# EAGLE design SensorBoard (EAGLE 6.4)
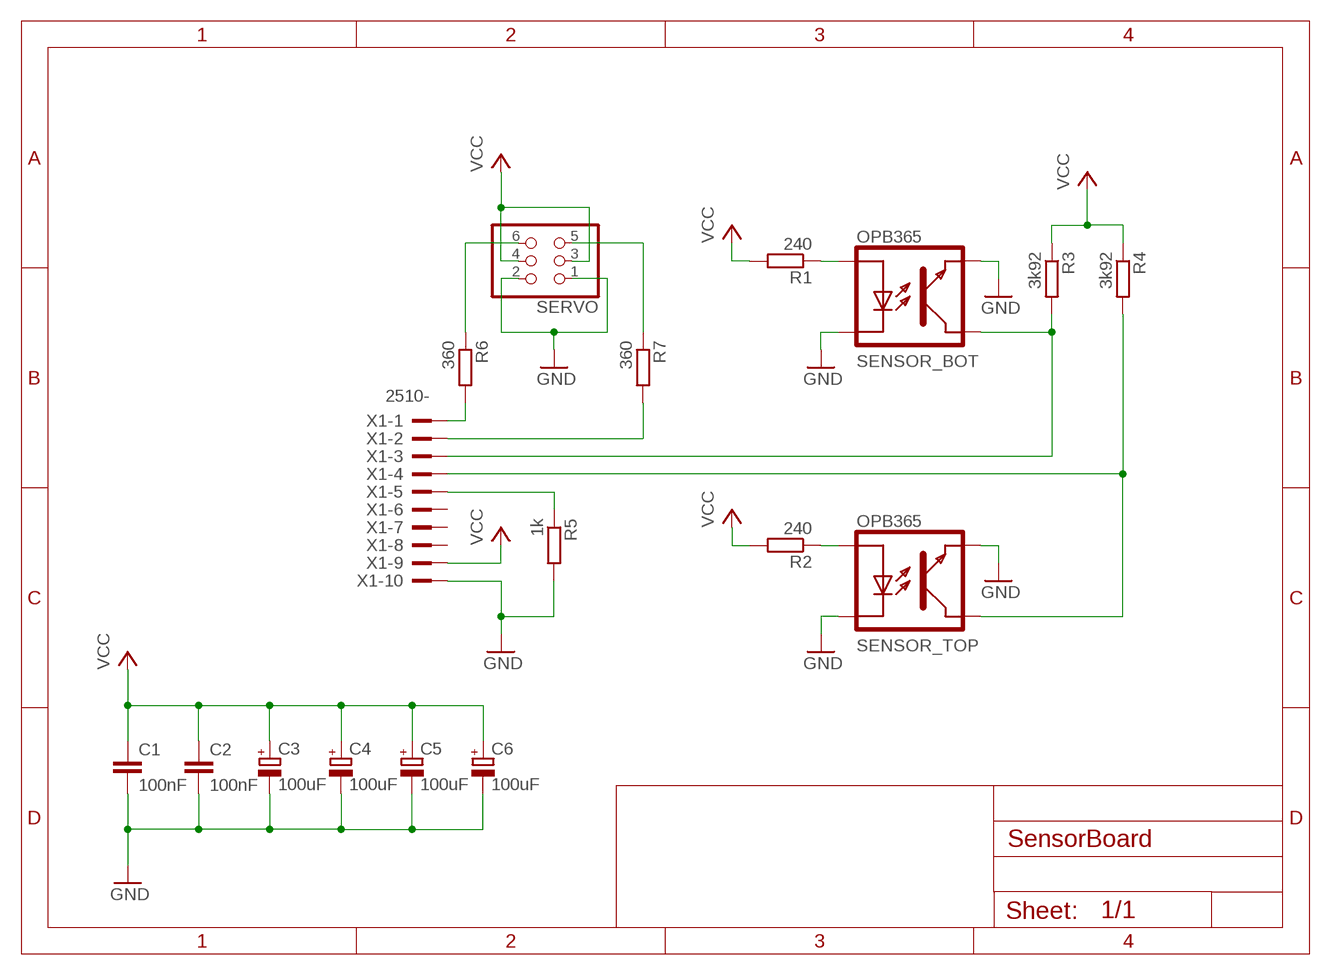
[diagram p0: schematic, sheet 1]

## Parts
C1  100nF  C-EUC1206  [C1206]
C2  100nF  C-EUC1206  [C1206]
C3  100uF  CPOL-EUSMCD  [SMC_D]
C4  100uF  CPOL-EUSMCD  [SMC_D]
C5  100uF  CPOL-EUSMCD  [SMC_D]
C6  100uF  CPOL-EUSMCD  [SMC_D]
R1  240  R-EU_R1206  [R1206]
R2  240  R-EU_R1206  [R1206]
R3  3k92  R-EU_R1206  [R1206]
R4  3k92  R-EU_R1206  [R1206]
R5  1k  R-EU_R1206  [R1206]
R6  360  R-EU_R1206  [R1206]
R7  360  R-EU_R1206  [R1206]
SENSOR_BOT  OPB365T  [OPB365-T]
SENSOR_TOP  OPB365T  [OPB365-T]
SERVO  PINHD-2X3/90  [2X03/90]
X1  2510-  [PAK100/2500-10]

## Nets
GND: C1.2 C2.2 C3.- C4.- C5.- C6.- R5.2 SENSOR_BOT.2 SENSOR_BOT.4 SENSOR_TOP.2 SENSOR_TOP.4 SERVO.1 SERVO.2 X1.10
N$1: R2.1 SENSOR_TOP.1
N$2: R1.1 SENSOR_BOT.1
N$3: R4.2 SENSOR_TOP.3 X1.4
N$4: R3.2 SENSOR_BOT.3 X1.3
N$5: R5.1 X1.5
N$6: R6.1 SERVO.6
N$7: R7.2 X1.2
N$8: R6.2 X1.1
N$9: R7.1 SERVO.5
VCC: C1.1 C2.1 C3.+ C4.+ C5.+ C6.+ R1.2 R2.2 R3.1 R4.1 SERVO.3 SERVO.4 X1.9
Unconnected: X1.6 X1.7 X1.8

## Library data of the parts
C1 C2 = rcl:C-EU: CAPACITOR, European symbol
C3-C6 = rcl:CPOL-EU: POLARIZED CAPACITOR, European symbol
R1-R7 = rcl:R-EU_: RESISTOR, European symbol
SENSOR_BOT SENSOR_TOP = tpv:OPB365T
SERVO = pinhead:PINHD-2X3: PIN HEADER
X1 = con-3m:2510-: 3M (TM) Pak 100 4-Wall Header Source: 3M; MF: 3M; MPN: 2510-6002UB; OC_FARNELL: 9838244; OC_NEWARK: 46F4725

## Board
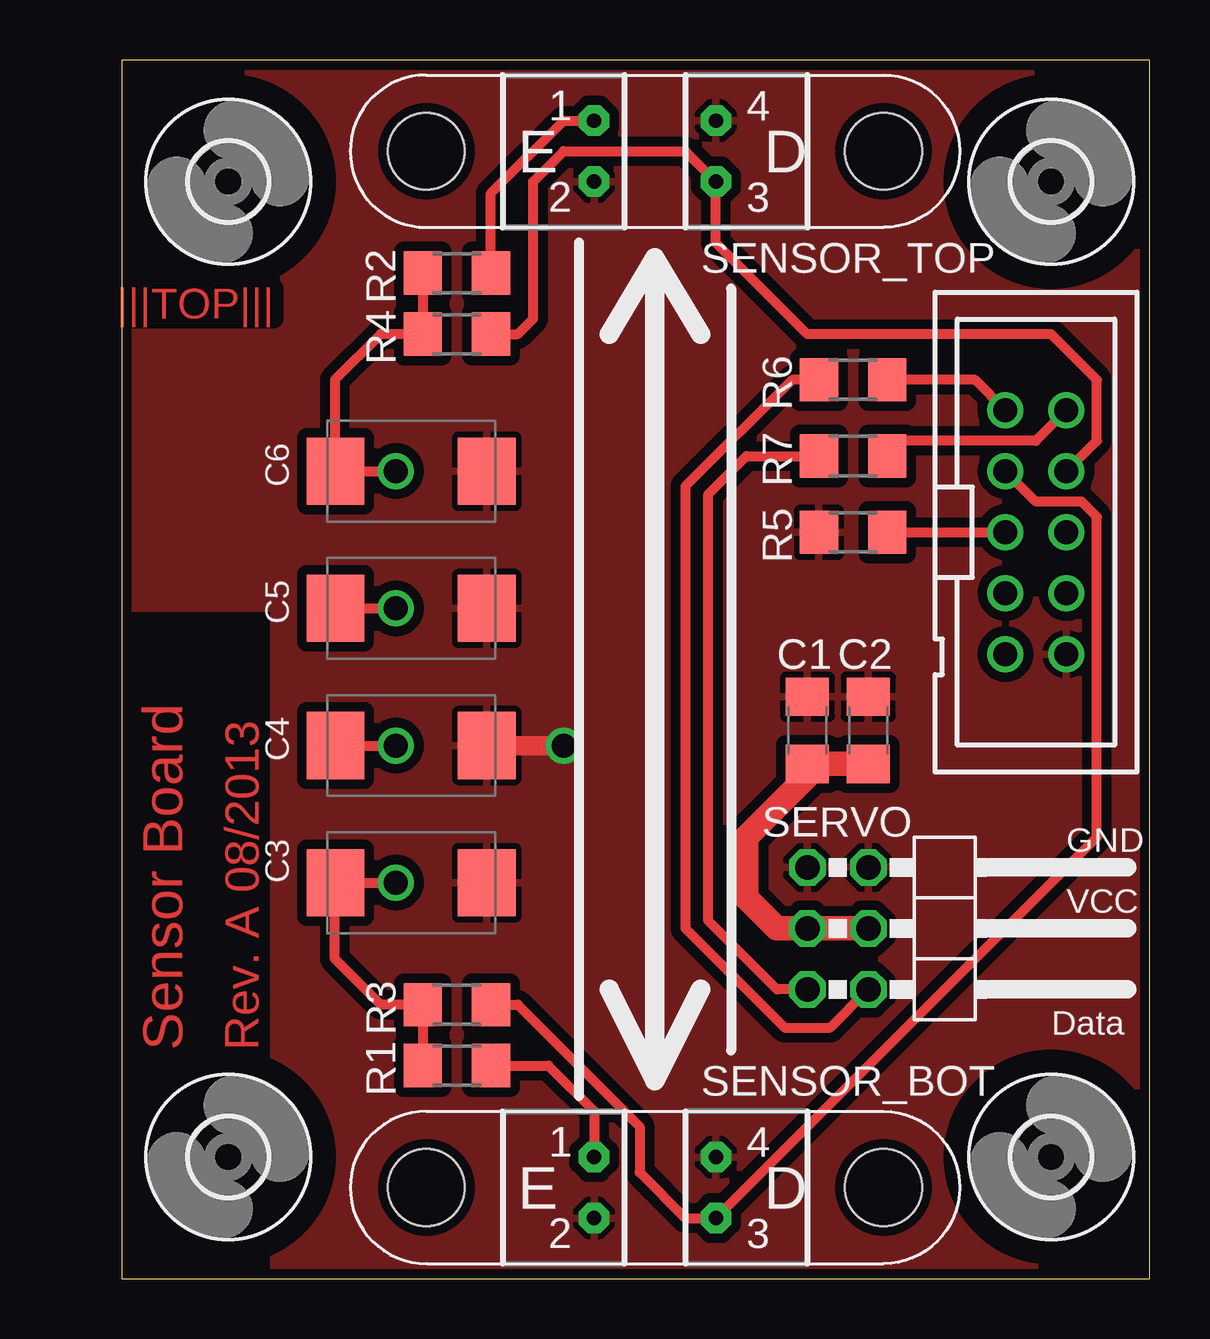
[diagram p1: board, top side]
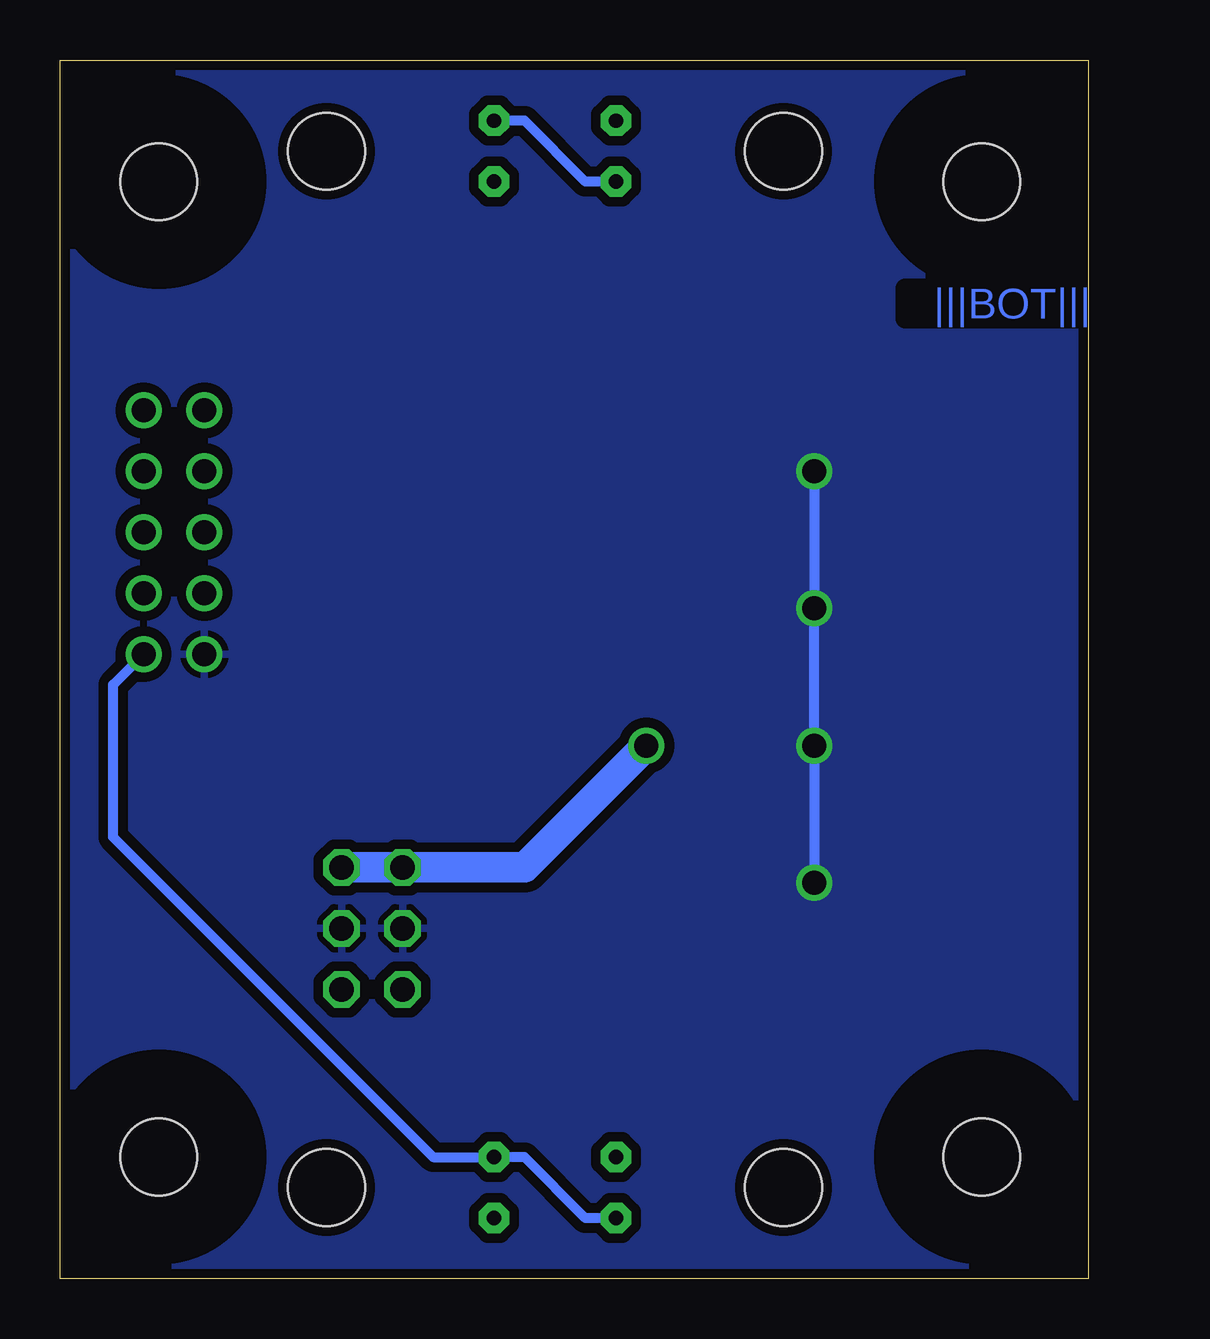
[diagram p2: board, bottom side, seen from below]

Size 42.85 x 50.79 mm. Coordinates in mm from the lower left corner, seen from the top.
Outline: 0,0 42.85,0 42.85,50.79 0,50.79 0,0
Copper layers (1*16): Top 0.0356mm / dielectric 1.5011mm / Bottom 0.0356mm
Design rules "LaenPCBOrder": minimum track width 6mil, minimum drill 13mil, track to track 6mil, track to pad 6mil, pad to pad 6mil, via to via 6mil, smd to smd 6mil, copper to edge 15mil, drill to drill 6mil, minimum pad ring 7mil, minimum via ring 7mil, stop-mask expansion 4mil, vias tented up to drill 0mil, thermal gap 10mil

### Footprints (pad centres in the part's own frame; a part is rotated, then mirrored left to right if it is on the bottom)
C1206 = smd 1.6 x 1.8: 1 -1.4,0; 2 1.4,0
SMC_D = smd 2.4 x 2.8: + -3.15,0; - 3.15,0
R1206 = smd 1.6 x 1.803: 1 -1.422,0; 2 1.422,0
OPB365-T = drill 0.6 pad 1.27 octagon: 1 -2.54,1.27; 2 -2.54,-1.27; 3 2.54,-1.27; 4 2.54,1.27 | hole 3.2: -9.525,0; 9.525,0
2X03/90 = drill 1.016 octagon: 1 -2.54,-6.35; 2 -2.54,-3.81; 3 0,-6.35; 4 0,-3.81; 5 2.54,-6.35; 6 2.54,-3.81
3,2 = hole 3.2: 0,0
PAK100/2500-10 = drill 1 pad 1.422: 1 -5.08,-1.27; 2 -5.08,1.27; 3 -2.54,-1.27; 4 -2.54,1.27; 5 0,-1.27; 6 0,1.27; 7 2.54,-1.27; 8 2.54,1.27; 9 5.08,-1.27; 10 5.08,1.27

### Placement (x,y rotation side)
C1  28.57,22.86 90 top
C2  31.11,22.86 90 top
C3  12.06,16.51 0 top
C4  12.06,22.23 0 top
C5  12.06,27.94 0 top
C6  12.06,33.66 0 top
R1  13.97,8.89 180 top
R2  13.97,41.91 180 top
R3  13.97,11.43 0 top
R4  13.97,39.37 0 top
R5  30.48,31.11 180 top
R6  30.48,37.47 0 top
R7  30.48,34.29 0 top
SENSOR_BOT  22.23,3.81 0 top
SENSOR_TOP  22.23,46.99 0 top
SERVO  34.92,14.61 270 top
U$1  [3,2]  38.73,45.72 0 top
U$2  [3,2]  4.45,45.72 0 top
U$3  [3,2]  38.73,5.08 0 top
U$4  [3,2]  4.45,5.08 0 top
X1  38.1,31.11 270 top

### Tracks (layer width: path | path; a pad name or v marks a point on that pad's centre or on a via)
GND  (via drill 1)
  Top 0.813: v18.41,22.23 C4.-
  Bottom 0.406: X1.10 40.64,24.77 40.64,18.41 27.3,5.08 SENSOR_BOT.4 23.5,5.08 20.95,2.54 SENSOR_BOT.2 | SENSOR_TOP.2 20.95,45.72 23.5,48.26 SENSOR_TOP.4
  Bottom 0.813: SERVO.2 SERVO.1
  Bottom 1.27: SERVO.2 23.5,17.14 v18.41,22.23
  pour Top (isolate 0.406): 0,50.8 0,27.94 6.35,27.94 6.35,0 42.55,0 42.55,50.8
N$1
  Top 0.406: R2.1 15.39,45.24 18.41,48.26 SENSOR_TOP.1
N$2
  Top 0.406: R1.1 17.78,8.89 19.68,6.99 SENSOR_BOT.1
N$3
  Top 0.406: X1.4 40.64,34.92 40.64,37.47 38.73,39.37 28.57,39.37 24.77,43.18 SENSOR_TOP.3 23.5,46.99 18.41,46.99 17.14,45.72 17.14,40.01 16.51,39.37 R4.2
N$4
  Top 0.406: R3.2 16.51,11.43 21.59,6.35 21.59,4.45 23.5,2.54 SENSOR_BOT.3 40.64,18.41 40.64,31.75 40.01,32.38 38.1,32.38 X1.3
N$5
  Top 0.406: R5.1 X1.5
N$6
  Top 0.406: R6.1 27.94,37.47 23.5,33.02 23.5,14.61 27.62,10.48 29.53,10.48 SERVO.6
N$7
  Top 0.406: X1.2 38.1,34.92 32.54,34.92 R7.2
N$8
  Top 0.406: X1.1 35.56,37.47 R6.2
N$9
  Top 0.406: SERVO.5 27.3,12.06 24.45,14.92 24.45,32.7 26.04,34.29 R7.1
VCC  (via drill 1)
  Top 0.406: R2.2 R4.1 10.79,39.37 8.89,37.47 8.89,33.68 C6.+ v11.43,33.66 | R1.2 R3.1 10.79,11.43 8.89,13.34 8.89,16.48 C3.+ v11.43,16.51 | C5.+ v11.43,27.94 | C4.+ v11.43,22.23
  Top 1.016: SERVO.4 SERVO.3 27.3,14.61 26.04,15.88 26.04,18.41 28.57,20.95 C1.1 C2.1
  Bottom 0.406: 11.43,33.02 v11.43,33.66 v11.43,27.94 v11.43,22.23 v11.43,16.51
  pour Bottom (isolate 0.406): 0,50.8 0,0 42.55,0 42.55,50.8

### Text on the board
Top: |||TOP||| | Sensor Board | Rev. A 08/2013
Bottom: |||BOT|||
tPlace: GND | VCC | Data